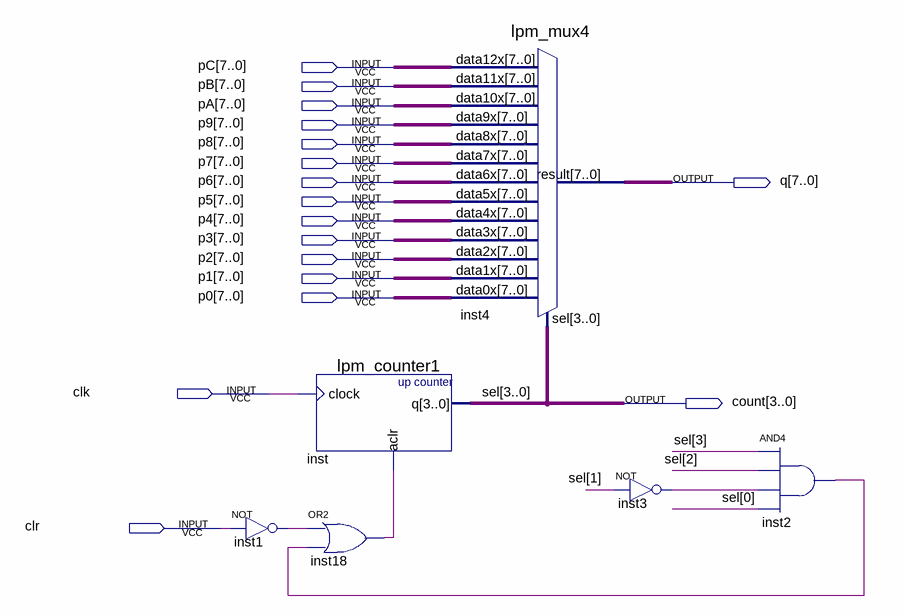
[diagram p0: schematic sheet]
// Quartus schematic display.bdf as structural Verilog: 6 symbols, 17 pins
module display (
  input  [7:0] pC,
  input  [7:0] pB,
  input  [7:0] pA,
  input  [7:0] p9,
  input  [7:0] p8,
  input  [7:0] p7,
  input  [7:0] p6,
  input  [7:0] p5,
  input  [7:0] p4,
  input  [7:0] p3,
  input  [7:0] p2,
  input  [7:0] p1,
  input  [7:0] p0,
  input  clk,
  input  clr,
  output [7:0] q,
  output [3:0] count
);

  wire inst1_out, inst2_out, inst3_out, inst18_out;

  lpm_counter1 inst (.clock(clk), .aclr(inst18_out), .q(count));
  not inst1 (inst1_out, clr);
  or inst18 (inst18_out, inst1_out, inst2_out);
  lpm_mux4 inst4 (
    .data12x(pC), .data11x(pB), .data10x(pA), .data9x(p9), .data8x(p8), .data7x(p7), .data6x(p6),
    .data5x(p5), .data4x(p4), .data3x(p3), .data2x(p2), .data1x(p1), .data0x(p0), .sel(count), .result(q));
  not inst3 (inst3_out, count[1]);
  and inst2 (inst2_out, count[3], count[2], inst3_out, count[0]);

  // Other names for the same wires on the sheet: sel[3:0] = count
endmodule
